# Altium schematic sheet Startracker_Mainboard.SchDoc
size A3; SheetNumber: 1; SheetTotal: 3
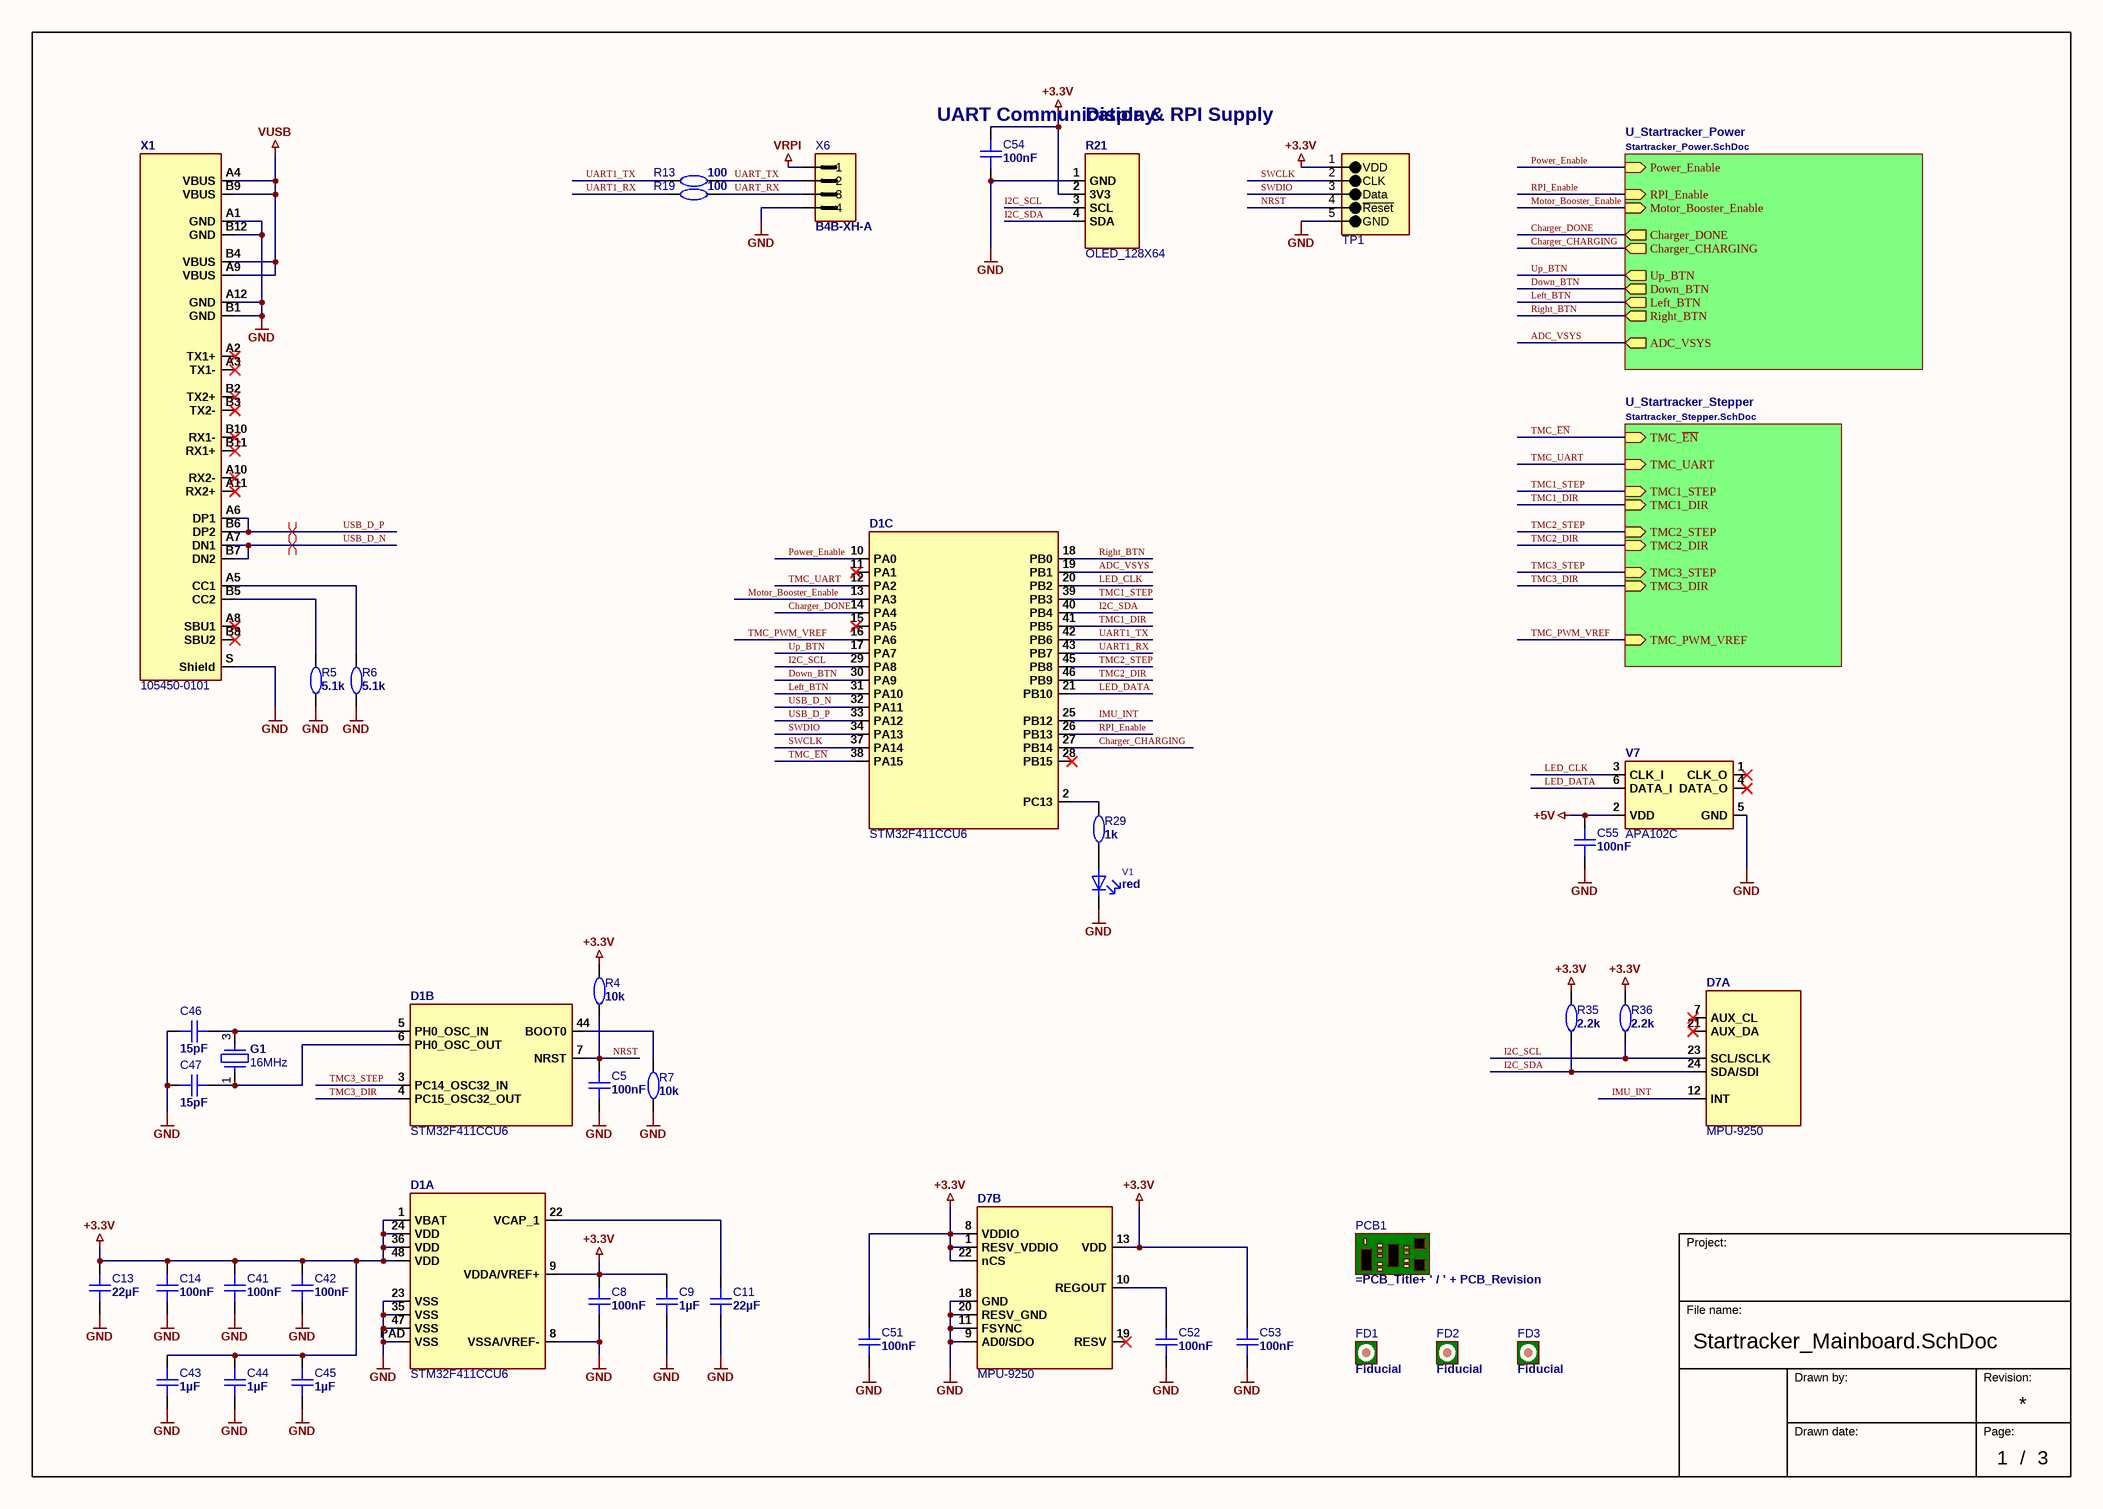
[diagram p0: Startracker_Mainboard.SchDoc]

## Parts
C5  value 100nF  [C-0603_1608_095_L_RF]  (hidden comment: Cap 100n 0603)
C8  value 100nF  [C-0603_1608_095_L_RF]  (hidden comment: Cap 100n 0603)
C9  value 1µF  [C-0603_1608_095_L_RF]  (hidden comment: Cap 1u 0603)
C11  value 22µF  [C-0603_1608_110_L_RF]  (hidden comment: Cap 22u/ 6.3V 0603)
C13  value 22µF  [C-0603_1608_110_L_RF]  (hidden comment: Cap 22u/ 6.3V 0603)
C14  value 100nF  [C-0603_1608_095_L_RF]  (hidden comment: Cap 100n 0603)
C41  value 100nF  [C-0603_1608_095_L_RF]  (hidden comment: Cap 100n 0603)
C42  value 100nF  [C-0603_1608_095_L_RF]  (hidden comment: Cap 100n 0603)
C43  value 1µF  [C-0603_1608_095_L_RF]  (hidden comment: Cap 1u 0603)
C44  value 1µF  [C-0603_1608_095_L_RF]  (hidden comment: Cap 1u 0603)
C45  value 1µF  [C-0603_1608_095_L_RF]  (hidden comment: Cap 1u 0603)
C46  value 15pF  [C-0603_1608_095_L_RF]  (hidden comment: Cap 15p 0603)
C47  value 15pF  [C-0603_1608_095_L_RF]  (hidden comment: Cap 15p 0603)
C51  value 100nF  [C-0603_1608_095_L_RF]  (hidden comment: Cap 100n 0603)
C52  value 100nF  [C-0603_1608_095_L_RF]  (hidden comment: Cap 100n 0603)
C53  value 100nF  [C-0603_1608_095_L_RF]  (hidden comment: Cap 100n 0603)
C54  value 100nF  [C-0603_1608_095_L_RF]  (hidden comment: Cap 100n 0603)
C55  value 100nF  [C-0603_1608_095_L_RF]  (hidden comment: Cap 100n 0603)
D1  STM32F411CCU6  [UFQFPN48_N_RF]  (parts A,B,C of 3)
D7  MPU-9250  [QFN24_N_RF]  (parts A,B of 2)
FD1  Fiducial  [Fiducial_1.0mm]  (no BOM)
FD2  Fiducial  [Fiducial_1.0mm]  (no BOM)
FD3  Fiducial  [Fiducial_1.0mm]  (no BOM)
G1  16MHz  [G_3225_N_RF]
PCB1  PCB_Dummy  [Dummy_PCB-Parameter_SM]  (value not drawn)
R4  value 10k  [R-0603_1608_050_L_RF]  (hidden comment: Res 10k 0603)
R5  value 5.1k  [R-0603_1608_050_L_RF]  (hidden comment: Res 5k1 0603)
R6  value 5.1k  [R-0603_1608_050_L_RF]  (hidden comment: Res 5k1 0603)
R7  value 10k  [R-0603_1608_050_L_RF]  (hidden comment: Res 10k 0603)
R13  value 100  [R-0603_1608_050_L_RF]  (hidden comment: Res 100R 0603)
R19  value 100  [R-0603_1608_050_L_RF]  (hidden comment: Res 100R 0603)
R21  OLED_128X64  [OLED_0.96]
R29  value 1k  [R-0603_1608_050_L_RF]  (hidden comment: Res 1k 0603)
R35  value 2.2k  [R-0603_1608_050_L_RF]  (hidden comment: Res 2k2 0603)
R36  value 2.2k  [R-0603_1608_050_L_RF]  (hidden comment: Res 2k2 0603)
TP1  Programming Interface 5P  [TP_ProgrammingInterface_5P_A]  (value not drawn)  (no BOM)
V1  value red  [LED-0603_1608_Red_L_RF]  (hidden comment: LED SMD 0603 Red)
V7  APA102C  [V_2020_P6_N_RF]
X1  105450-0101  [105450-0101]
X6  value B4B-XH-A  [X-0124X0057-R_M04_P0250_JST_B4B-XH-A]  (hidden comment: CONN HEADER XH 4POS THT)

## Sub-sheets
U_Startracker_Power = Startracker_Power.SchDoc: Motor_Booster_Enable (in), Power_Enable (in), RPI_Enable (in), Charger_CHARGING (out), Charger_DONE (out), Up_BTN (out), Left_BTN (out), Right_BTN (out), ADC_VSYS (out), Down_BTN (out)
U_Startracker_Stepper = Startracker_Stepper.SchDoc: TMC_~{EN} (in), TMC1_STEP (in), TMC1_DIR (in), TMC2_STEP (in), TMC2_DIR (in), TMC3_STEP (in), TMC3_DIR (in), TMC_PWM_VREF (in), TMC_UART (in)

## Nets
+3.3V: C8.1 C9.2 C13.2 C14.1 C41.1 C42.1 C43.2 C44.2 C45.2 C51.1 C53.1 C54.1 D1.1(VBAT) D1.9(VDDA/VREF+) D1.24(VDD) D1.36(VDD) D1.48(VDD) D7.1(RESV_VDDIO) D7.8(VDDIO) D7.13(VDD) D7.22(nCS) R4.2 R21.2(3V3) R35.1 R36.1 TP1.1(VDD)
+5V: C55.1 V7.2(VDD)
GND: C5.2 C8.2 C9.1 C11.1 C13.1 C14.2 C41.2 C42.2 C43.1 C44.1 C45.1 C46.2 C47.2 C51.2 C52.2 C53.2 C54.2 C55.2 D1.8(VSSA/VREF-) D1.23(VSS) D1.35(VSS) D1.47(VSS) D1.PAD(VSS) D7.9(AD0/SDO) D7.11(FSYNC) D7.18(GND) D7.20(RESV_GND) R5.1 R6.1 R7.1 R21.1(GND) TP1.5(GND) V1.2 V7.5(GND) X1.A1(GND) X1.A12(GND) X1.B1(GND) X1.B12(GND) X1.S(Shield) X6.4
VRPI: X6.1
VUSB: X1.A4(VBUS) X1.A9(VBUS) X1.B4(VBUS) X1.B9(VBUS)
ADC_VSYS: D1.19(PB1) ; sheet U_Startracker_Power/ADC_VSYS
Charger_CHARGING: D1.27(PB14) ; sheet U_Startracker_Power/Charger_CHARGING
Charger_DONE: D1.14(PA4) ; sheet U_Startracker_Power/Charger_DONE
Down_BTN: D1.30(PA9) ; sheet U_Startracker_Power/Down_BTN
I2C_SCL: D1.29(PA8) D7.23(SCL/SCLK) R21.3(SCL) R36.2
I2C_SDA: D1.40(PB4) D7.24(SDA/SDI) R21.4(SDA) R35.2
IMU_INT: D1.25(PB12) D7.12(INT)
LED_CLK: D1.20(PB2) V7.3(CLK_I)
LED_DATA: D1.21(PB10) V7.6(DATA_I)
Left_BTN: D1.31(PA10) ; sheet U_Startracker_Power/Left_BTN
Motor_Booster_Enable: D1.13(PA3) ; sheet U_Startracker_Power/Motor_Booster_Enable
NRST: C5.1 D1.7(NRST) R4.1 TP1.4(~{Reset})
Power_Enable: D1.10(PA0) ; sheet U_Startracker_Power/Power_Enable
Right_BTN: D1.18(PB0) ; sheet U_Startracker_Power/Right_BTN
RPI_Enable: D1.26(PB13) ; sheet U_Startracker_Power/RPI_Enable
SWCLK: D1.37(PA14) TP1.2(CLK)
SWDIO: D1.34(PA13) TP1.3(Data)
TMC1_DIR: D1.41(PB5) ; sheet U_Startracker_Stepper/TMC1_DIR
TMC1_STEP: D1.39(PB3) ; sheet U_Startracker_Stepper/TMC1_STEP
TMC2_DIR: D1.46(PB9) ; sheet U_Startracker_Stepper/TMC2_DIR
TMC2_STEP: D1.45(PB8) ; sheet U_Startracker_Stepper/TMC2_STEP
TMC3_DIR: D1.4(PC15_OSC32_OUT) ; sheet U_Startracker_Stepper/TMC3_DIR
TMC3_STEP: D1.3(PC14_OSC32_IN) ; sheet U_Startracker_Stepper/TMC3_STEP
TMC_~{EN}: D1.38(PA15) ; sheet U_Startracker_Stepper/TMC_~{EN}
TMC_PWM_VREF: D1.16(PA6) ; sheet U_Startracker_Stepper/TMC_PWM_VREF
TMC_UART: D1.12(PA2) ; sheet U_Startracker_Stepper/TMC_UART
UART1_RX: D1.43(PB7) R19.1
UART1_TX: D1.42(PB6) R13.1
UART_RX: R19.2 X6.3
UART_TX: R13.2 X6.2
Up_BTN: D1.17(PA7) ; sheet U_Startracker_Power/Up_BTN
USB_D_N: D1.32(PA11) X1.A7(DN1) X1.B7(DN2)
USB_D_P: D1.33(PA12) X1.A6(DP1) X1.B6(DP2)
NetC11_2: C11.2 D1.22(VCAP_1)
NetC46_1: C46.1 D1.5(PH0_OSC_IN) G1.3
NetC47_1: C47.1 D1.6(PH0_OSC_OUT) G1.1
NetC52_1: C52.1 D7.10(REGOUT)
NetD1_2: D1.2(PC13) R29.2
NetD1_44: D1.44(BOOT0) R7.2
NetR5_2: R5.2 X1.B5(CC2)
NetR6_2: R6.2 X1.A5(CC1)
NetR29_1: R29.1 V1.1

Not connected (* = marked no-connect by the designer): D1 11(PA1)* 15(PA5)* 28(PB15)*; D7 7(AUX_CL)* 19(RESV)* 21(AUX_DA)*; V7 1(CLK_O)* 4(DATA_O)*; X1 A2(TX1+)* A3(TX1-)* A8(SBU1)* A10(RX2-)* A11(RX2+)* B2(TX2+)* B3(TX2-)* B8(SBU2)* B10(RX1-)* B11(RX1+)*

## Layout directives
differential pair; differential pair class USB: USB_D_N, USB_D_P

## Notes on the sheet
- UART Communication & RPI Supply
- Display
- Project:
- File name:
- Drawn by:
- Revision:
- Drawn date:
- Page:
- /

## Library data of the parts
C5 C8 C14 C41 C42 C51-C55 = CMP-001-0037-3: Cap Cer SMD 100n 50V 10% 0603 X7R; Manufacturer: KEMET; Manufacturer Part Number: C0603C104K5RAC; User: epph; Prefered: true; MNL_Number: 22310507; GPV_Number: 1749.0075; Case / Package: 0603; PartStatus: Release; Technology: SMT; ClassName: Surface_Assy
C9 C43-C45 = CMP-001-0045-2: Cap Cer SMD 1u 16V 10% 0603 X7R; Manufacturer Part Number: 0603YC105KAT*; Manufacturer: AVX; Prefered: true; User: zupa; GPV_Number: 1749.0125; MNL_Number: 22310613; ComponentLink1Description: Datasheet; ClassName: Surface_Assy; PartStatus: Release; Case / Package: 0603; ComponentLink1URL: https://datasheet.ciiva.com/11464/ccog-11464569.pdf; Technology: SMT
C11 C13 = CMP-001-0140-2: Cap Cer SMD 22u 6.3V 20% 0603 X5R; Manufacturer Part Number: C1608X5R0J226M080AC; Manufacturer: TDK; Prefered: false; GPV_Number: 1749.0255; User: zupa; PartStatus: Release; Technology: SMT; ComponentLink1Description: Datasheet; ComponentLink1URL: https://datasheet.ciiva.com/24454/c1608x5r0j226m080ac-24454269.pdf; ClassName: Surface_Assy; Case / Package: 0603
C46 C47 = CMP-001-0043-2: Cap Cer SMD 15p 50V 5% 0603 C0G; Manufacturer: AVX; Manufacturer Part Number: 06035A150JAT*; Prefered: true; User: zupa; GPV_Number: 1749.0057; Case / Package: 0603; ClassName: Surface_Assy; PartStatus: Release; Technology: SMT; ComponentLink1Description: Datasheet; ComponentLink1URL: https://datasheet.ciiva.com/11464/ccog-11464569.pdf
D1 = STM32F411CCU6: IC MCU Cortex-M4 256k Flash 128k RAM; Part_validated: No; Manufacturer: ST Microelectronics; GPV_Number: xxxx.xxxx; MNL_Number: xxxxxxxx; Value: STM32F411CCU6; Footprint_validated: No; PartStatus: New; System: -; ClassName: Surface_Assy; Case/Package: UFQFPN48; Technology: SMT; Manufacturer Part Number: STM32F411CCU6
D7 = MPU-9250: IC IMU 9-Axis Attitude Sensor; Part_validated: No; Manufacturer: InvenSense; GPV_Number: xxxx.xxxx; MNL_Number: xxxxxxxx; Value: MPU-9250; Footprint_validated: No; PartStatus: New; System: -; ClassName: Surface_Assy; Case/Package: QFN24; Technology: SMT; Manufacturer Part Number: MPU-9250
FD1-FD3 = CMP-001-1312-3: Fiducial Mark; User: balu; PartStatus: Release; Value: Fiducial; ClassName: Symbol; Technology: SYM
G1 = X322516MMB4SI: Crystal Oscillator 16MHz 10pF ±10ppm LCSC C112972; Part_validated: No; Manufacturer: Yangwing Tech; GPV_Number: xxxx.xxxx; MNL_Number: xxxxxxxx; Value: 16MHz; Footprint_validated: No; PartStatus: New; System: -; ClassName: Surface_Assy; Case/Package: 2532; Technology: SMT; Manufacturer Part Number: X322516MMB4SI
PCB1 = CMP-001-1147-5: <PCB DesignName Revision>; User: balu; ClassName: Symbol; Technology: SYM; Value: =PCB_Title+ ' / ' + PCB_Revision; GPV_Number: =PCB_PartNo; PartStatus: Release
R4 R7 = CMP-001-0241-3: Res SMD 10k 1% 0.1W 0603; Manufacturer: YAGEO; Manufacturer Part Number: RC0603FR-0710KL; MNL_Number: 15310022; GPV_Number: 1922.0100; User: zupa; Prefered: true; Case / Package: 0603; ClassName: Surface_Assy; PartStatus: Release; ComponentLink1URL: https://datasheet.ciiva.com/11808/0900766b80f96399-11808280.pdf; ComponentLink1Description: Datasheet; Technology: SMT
R5 R6 = CMP-001-0582-3: Res SMD 5k1 1% 0.1W 0603; Manufacturer Part Number: RC0603FR-075K1L; Manufacturer: YAGEO; Prefered: true; GPV_Number: 1922.0144; User: napa; Technology: SMT; ComponentLink1URL: https://datasheet.ciiva.com/8895/pyu-rc0603-51-rohs-l-4-8895189.pdf; PartStatus: Release; ClassName: Surface_Assy; ComponentLink1Description: Datasheet; Case / Package: 0603
R13 R19 = CMP-001-0240-3: Res SMD 100R 1% 0.1W 0603; Manufacturer: YAGEO; Manufacturer Part Number: RC0603FR-07100RL; Prefered: true; User: zupa; MNL_Number: 15310004; GPV_Number: 1922.0102; ClassName: Surface_Assy; Case / Package: 0603; ComponentLink1Description: Datasheet; Technology: SMT; ComponentLink1URL: https://datasheet.ciiva.com/11808/0900766b80f96399-11808280.pdf; PartStatus: Release
R21 = Display_0.96: OLED Display I2C 128X64 0.96"; Part_validated: No; GPV_Number: xxxx.xxxx; MNL_Number: xxxxxxxx; Value: OLED_128X64; Footprint_validated: No; PartStatus: New; System: -; Case/Package: 4SIL; Technology: TMT; Manufacturer: *; Manufacturer Part Number: *; ClassName: Through-Hole_Assy
R29 = CMP-001-0250-3: Res SMD 1k 1% 0.1W 0603; Manufacturer: YAGEO; Manufacturer Part Number: RC0603FR-071KL; MNL_Number: 15310012; User: zupa; GPV_Number: 1922.0011; Prefered: true; Technology: SMT; ComponentLink1Description: Datasheet; ClassName: Surface_Assy; ComponentLink1URL: https://datasheet.ciiva.com/11808/0900766b80f96399-11808280.pdf; Case / Package: 0603; PartStatus: Release
R35 R36 = CMP-001-0261-3: Res SMD 2k2 1% 0.1W 0603; Manufacturer: YAGEO; Manufacturer Part Number: RC0603FR-072K2L; Prefered: true; User: zupa; GPV_Number: 1922.1472; ClassName: Surface_Assy; ComponentLink1Description: Datasheet; PartStatus: Release; ComponentLink1URL: https://datasheet.ciiva.com/11808/0900766b80f96399-11808280.pdf; Case / Package: 0603; Technology: SMT
TP1 = CMP-001-1519-1: User: zupa; Value: TP; System: Connector; GPV_Number: -; Technology: SMT; ClassName: Surface_Assy; PartStatus: Release
V1 = CMP-001-1207-6: LED RED LTST-C190KDKT-10A 0603; Manufacturer: Lite-On Inc; GPV_Number: 1602.0727; User: epph; Technology: SMT; Manufacturer Part Number: LTST-C190KDKT-10A; Case / Package: 0603; ClassName: Surface_Assy; PartStatus: Release
V7 = APA102C: RGB LED SPI Interface; Part_validated: No; Manufacturer: APA Electronic CO; Manufacturer Part Number: APA-102-2020-256-8A; GPV_Number: xxxx.xxxx; MNL_Number: xxxxxxxx; Value: APA102C; Footprint_validated: No; PartStatus: New; System: -; ClassName: Surface_Assy; Case/Package: 2020; Technology: SMT
X1 = 105450-0101: CONN USB-C 16pin; Part_validated: No; Manufacturer: Molex; GPV_Number: xxxx.xxxx; System: Connector; MNL_Number: xxxxxxxx; Value: 105450-0101; Footprint_validated: No; PartStatus: New; ClassName: Through-Hole_Assy; Case/Package: USB-C; Technology: SMT; Manufacturer Part Number: 105450-0101
X6 = CMP-00142-3: CONN HEADER  4POS_JST_B4B-XH; Manufacturer: JST; System: Connector; User: balu; GPV_Number: 4401.1048; ClassName: Through-Hole_Assy; Technology: THT; Manufacturer Part Number: B4B-XH-A; PartStatus: Release